# Altium schematic sheet zulu_a7_3.SchDoc
size 270 x 341 mm; Author: Christian Tambe; VERSION#: 1.0; Origin: Eagle; OriginPath: C:\Users\tambe\Documents\Electronics\Zulu_A7\Zulu_Altrium\zulu_a7.sch; OriginSheet: 4; OriginDescription: Memory
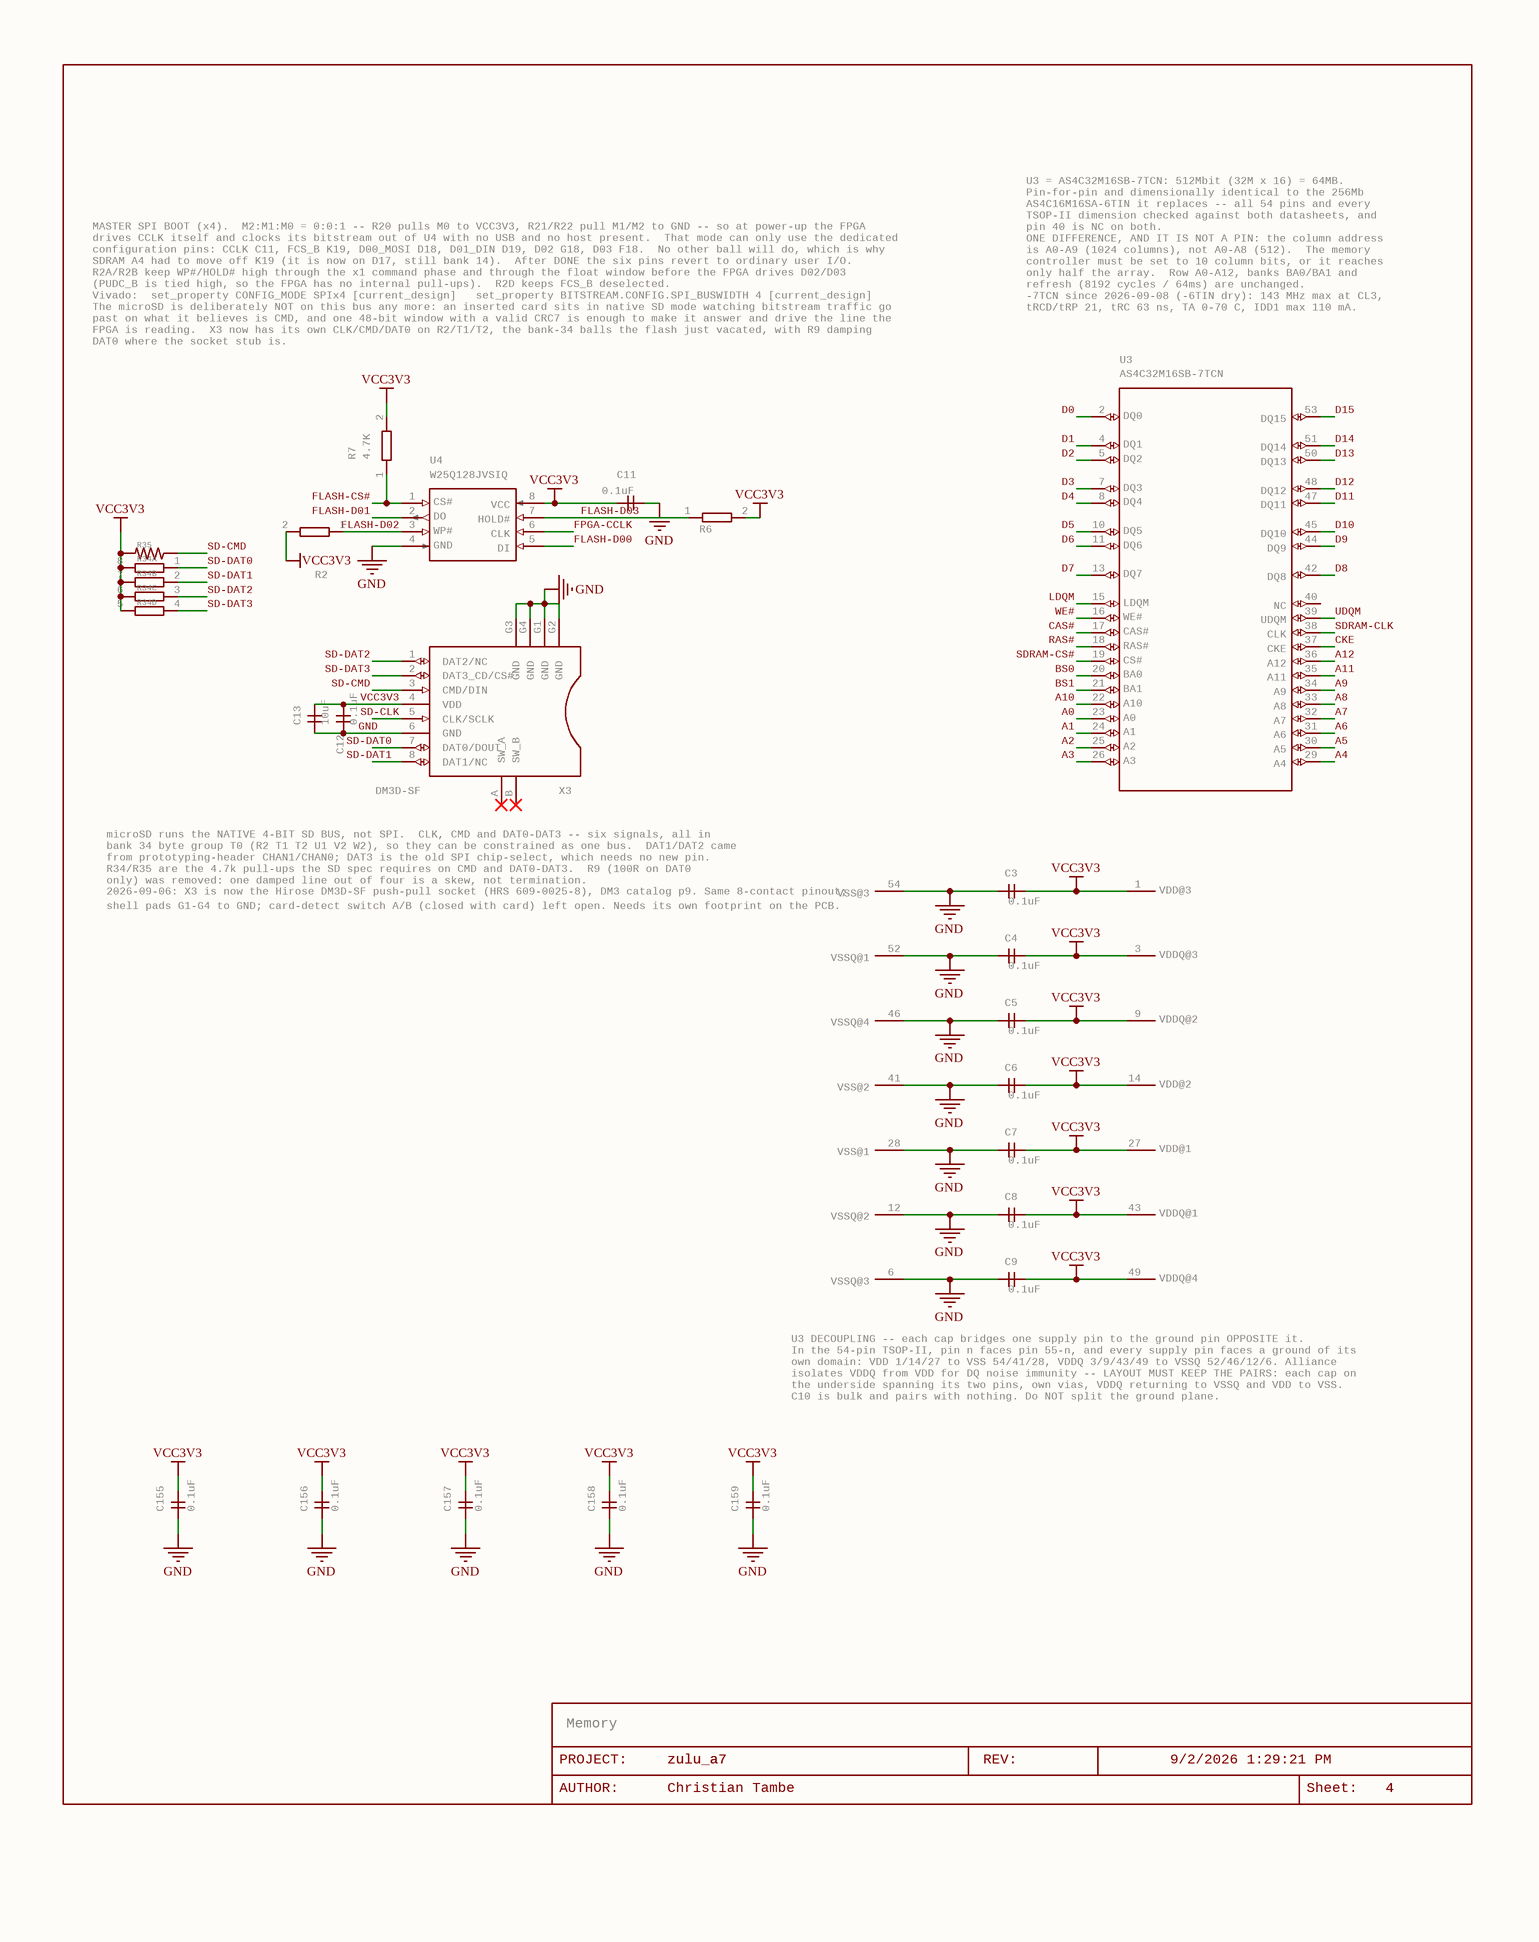
[diagram p0: zulu_a7_3.SchDoc]

## Parts
C3  0.1uF  [C0402]
C4  0.1uF  [C0402]
C5  0.1uF  [C0402]
C6  0.1uF  [C0402]
C7  0.1uF  [C0402]
C8  0.1uF  [C0402]
C9  0.1uF  [C0402]
C11  0.1uF  [C0402]
C12  0.1uF  [C0402]
C13  10uF  [C0603]
C155  0.1uF  [C0201]
C156  0.1uF  [C0201]
C157  0.1uF  [C0201]
C158  0.1uF  [C0201]
C159  0.1uF  [C0201]
FRAME7  LAST_DATE_TIME: 9/2/2026 1:29:21 PM  Sheet: Sheet:  SHEET: 4  REV: REV:  PROJECT: PROJECT:  DRAWING_NAME: zulu_a7  AUTHOR: Christian Tambe  (hidden comment: DOCFIELD)  (graphical)
R2  4.7K  [R0201]  (value not drawn)
R6  4.7K  [R0201]  (value not drawn)
R7  4.7K  [R0201]
R34  4.7K  [742C083]  (value not drawn)  (parts A,B,C,D of 4)
R35  4.7K  [R0402]  (value not drawn)
U3  AS4C32M16SB-7TCN  PART: U3  [TSOPII-54]  (parts A,B,C,D,E,F,G,H,I,J,K,L,M,N,O,P,Q,R,S,T,U,V,W,X,Y,Z,27,28,29,30,31,32,33,34,35,36,37,38,39,40,41,42,43,44,45,46,47,48,49,50,51,52,53,54,55 of 55)
U4  W25Q128JVSIQ  PART: U4  [SOIC-8_208MIL]  (parts A,B,C,D,E,F,G,H,I of 9)
X3  DM3D-SF  [DM3D-SF]

## Nets
GND: C3.1 C4.1 C5.1 C6.1 C7.1 C8.1 C9.1 C11.1 C12.1 C13.1 C155.1 C156.1 C157.1 C158.1 C159.1 U3.6(P$1) U3.12(P$1) U3.28(P$1) U3.41(P$1) U3.46(P$1) U3.52(P$1) U3.54(P$1) U4.4 X3.6(GND) X3.G1(GND) X3.G2(GND) X3.G3(GND) X3.G4(GND)
VCC3V3: C3.2 C4.2 C5.2 C6.2 C7.2 C8.2 C9.2 C11.2 C12.2 C13.2 C155.2 C156.2 C157.2 C158.2 C159.2 R2.2 R6.2 R7.2 R34.5 R34.6 R34.7 R34.8 R35.2 U3.1(P$1) U3.3(P$1) U3.9(P$1) U3.14(P$1) U3.27(P$1) U3.43(P$1) U3.49(P$1) U4.8 X3.4(VDD)
A0: U3.23(P$1)
A1: U3.24(P$1)
A2: U3.25(P$1)
A3: U3.26(P$1)
A4: U3.29(P$1)
A5: U3.30(P$1)
A6: U3.31(P$1)
A7: U3.32(P$1)
A8: U3.33(P$1)
A9: U3.34(P$1)
A10: U3.22(P$1)
A11: U3.35(P$1)
A12: U3.36(P$1)
BS0: U3.20(P$1)
BS1: U3.21(P$1)
CAS#: U3.17(P$1)
CKE: U3.37(P$1)
D0: U3.2(P$1)
D1: U3.4(P$1)
D2: U3.5(P$1)
D3: U3.7(P$1)
D4: U3.8(P$1)
D5: U3.10(P$1)
D6: U3.11(P$1)
D7: U3.13(P$1)
D8: U3.42(P$1)
D9: U3.44(P$1)
D10: U3.45(P$1)
D11: U3.47(P$1)
D12: U3.48(P$1)
D13: U3.50(P$1)
D14: U3.51(P$1)
D15: U3.53(P$1)
FLASH-CS#: R7.1 U4.1
FLASH-D00: U4.5
FLASH-D01: U4.2
FLASH-D02: R2.1 U4.3
FLASH-D03: R6.1 U4.7
FPGA-CCLK: U4.6
LDQM: U3.15(P$1)
RAS#: U3.18(P$1)
SD-CLK: X3.5(CLK/SCLK)
SD-CMD: R35.1 X3.3(CMD/DIN)
SD-DAT0: R34.1 X3.7(DAT0/DOUT)
SD-DAT1: R34.2 X3.8(DAT1/NC)
SD-DAT2: R34.3 X3.1(DAT2/NC)
SD-DAT3: R34.4 X3.2(DAT3_CD/CS#)
SDRAM-CLK: U3.38(P$1)
SDRAM-CS#: U3.19(P$1)
UDQM: U3.39(P$1)
WE#: U3.16(P$1)

Not connected (* = marked no-connect by the designer): U3 40(P$1); X3 A(SW_A)* B(SW_B)*

## Notes on the sheet
- (near U3) U3 = AS4C32M16SB-7TCN: 512Mbit (32M x 16) = 64MB.
  Pin-for-pin and dimensionally identical to the 256Mb
  AS4C16M16SA-6TIN it replaces -- all 54 pins and every
  TSOP-II dimension checked against both datasheets, and
  pin 40 is NC on both.
  ONE DIFFERENCE, AND IT IS NOT A PIN: the column address
  is A0-A9 (1024 columns), not A0-A8 (512).  The memory
  controller must be set to 10 column bits, or it reaches
  only half the array.  Row A0-A12, banks BA0/BA1 and
  refresh (8192 cycles / 64ms) are unchanged.
  -7TCN since 2026-09-08 (-6TIN dry): 143 MHz max at CL3,
  tRCD/tRP 21, tRC 63 ns, TA 0-70 C, IDD1 max 110 mA.
- MASTER SPI BOOT (x4).  M2:M1:M0 = 0:0:1 -- R20 pulls M0 to VCC3V3, R21/R22 pull M1/M2 to GND -- so at power-up the FPGA
  drives CCLK itself and clocks its bitstream out of U4 with no USB and no host present.  That mode can only use the dedicated
  configuration pins: CCLK C11, FCS_B K19, D00_MOSI D18, D01_DIN D19, D02 G18, D03 F18.  No other ball will do, which is why
  SDRAM A4 had to move off K19 (it is now on D17, still bank 14).  After DONE the six pins revert to ordinary user I/O.
  R2A/R2B keep WP#/HOLD# high through the x1 command phase and through the float window before the FPGA drives D02/D03
  (PUDC_B is tied high, so the FPGA has no internal pull-ups).  R2D keeps FCS_B deselected.
  Vivado:  set_property CONFIG_MODE SPIx4 [current_design]   set_property BITSTREAM.CONFIG.SPI_BUSWIDTH 4 [current_design]
  The microSD is deliberately NOT on this bus any more: an inserted card sits in native SD mode watching bitstream traffic go
  past on what it believes is CMD, and one 48-bit window with a valid CRC7 is enough to make it answer and drive the line the
  FPGA is reading.  X3 now has its own CLK/CMD/DAT0 on R2/T1/T2, the bank-34 balls the flash just vacated, with R9 damping
  DAT0 where the socket stub is.
- (near U3) microSD runs the NATIVE 4-BIT SD BUS, not SPI.  CLK, CMD and DAT0-DAT3 -- six signals, all in
  bank 34 byte group T0 (R2 T1 T2 U1 V2 W2), so they can be constrained as one bus.  DAT1/DAT2 came
  from prototyping-header CHAN1/CHAN0; DAT3 is the old SPI chip-select, which needs no new pin.
  R34/R35 are the 4.7k pull-ups the SD spec requires on CMD and DAT0-DAT3.  R9 (100R on DAT0
  only) was removed: one damped line out of four is a skew, not termination.
- 2026-09-06: X3 is now the Hirose DM3D-SF push-pull socket (HRS 609-0025-8), DM3 catalog p9. Same 8-contact pinout;
- shell pads G1-G4 to GND; card-detect switch A/B (closed with card) left open. Needs its own footprint on the PCB.
- U3 DECOUPLING -- each cap bridges one supply pin to the ground pin OPPOSITE it.
  In the 54-pin TSOP-II, pin n faces pin 55-n, and every supply pin faces a ground of its
  own domain: VDD 1/14/27 to VSS 54/41/28, VDDQ 3/9/43/49 to VSSQ 52/46/12/6. Alliance
  isolates VDDQ from VDD for DQ noise immunity -- LAYOUT MUST KEEP THE PAIRS: each cap on
  the underside spanning its two pins, own vias, VDDQ returning to VSSQ and VDD to VSS.
  C10 is bulk and pairs with nothing. Do NOT split the ground plane.
- (near FRAME7) Memory
- (near FRAME7) AUTHOR:

## Library data of the parts
C3-C9 C11 C12 = C-GENERICC0402: CAPACITOR, generic non-polarized, horizontal pins; GateName_1: G$1; SymbolName_1: C-GENERIC-H; MANF: Murata; MANF#: GRM155R71C104KA88D; SPEC: X7R 16V +-10%, 0.50 mm max; DeviceName: C0402; LibraryName: rcl; DeviceSetName: C-GENERIC
C13 = C-GENERICC0603: CAPACITOR, generic non-polarized, horizontal pins; GateName_1: G$1; SymbolName_1: C-GENERIC-H; MANF: Murata; MANF#: GRM188R60J106ME47D; SPEC: X5R 6.3V +-20%, 0.90 mm max; DeviceName: C0603; LibraryName: rcl; DeviceSetName: C-GENERIC
C155-C159 = C-GENERICC0201: CAPACITOR, generic non-polarized, horizontal pins; GateName_1: G$1; SymbolName_1: C-GENERIC-H; MANF: Murata; MANF#: GRM033R61A104KE15D; NOTE: RETURN-PATH STITCHING FOR THE L5 PLANE, NOT DECOUPLING.  L5 carries VCC3V3 and L2 carries GND, so a signal via that moves between an L2-referenced layer (Top, L3) and an L5-referenced one (L4, Bottom) has nowhere for its return current to go except through a VCC3V3-to-GND capacitor.  Fifty-two vias on this board do that and thirty-nine of them are the AS4C32M16SB bus; before these five parts the nearest such capacitor was a median of 3.30 mm and up to 12.70 mm away, because all forty-six sit in the y 3.0-4.2 row, round U1, or at x 2.6-7.6, and none was anywhere in x 12-39, y 6-25.4.  These five fill that hole: C155 (26.000,20.250) Top carries UDQM, CKE and A12; C156 (29.550,20.000) Bottom carries D10 and D11; C157 (39.050,18.000) Top carries D13 and is also the best path for D3 and D6; C158 (18.100,16.650) Top carries the west address row A5, A7, A9; C159 (23.300,7.500) Top carries the south control row BS0, RAS#, A0, A1, which had the worst return paths on the board.  THEIR VALUE IS IN THE PLACEMENT AND IN THE TWO VIAS BESIDE EACH ONE, NOT IN THE CAPACITANCE: with roughly 2 nH of mounting inductance a 100 nF 0201 self-resonates near 11 MHz, so at the 143 MHz bus clock and above the capacitance is irrelevant and the impedance is set entirely by the loop -- the unavoidable barrel across the 1.3512 mm L2-to-L5 cavity plus the pad-to-via tie, which is the one term a layout can shorten.  Each of these five is tied to its two planes by its own dedicated via 0.85-1.07 mm of copper away, against a 2.43 mm median for the other forty-six.  DO NOT move these parts, do not re-route or lengthen their stubs, do not delete either via, and do not substitute a larger case size: a 0402 would push the vias apart and undo the point.  If the value must change, smaller is better than larger.  Coordinates and the full measurement are in docs/stage5b_stitching_caps.md.; SPEC: X5R 10V +-10% 0201 0.1uF, 0.30 mm max -- VCC3V3-to-GND return-path stitch for the L5 plane change, added 2026-09-24; DeviceName: C0201; LibraryName: rcl; DeviceSetName: C-GENERIC
FRAME7 = DOCFIELD: DOCUMENT FIELD; GateName_1: G$1; SymbolName_1: DOCFIELD; LibraryName: ctambe; DeviceSetName: DOCFIELD
R2 R6 R7 = R-WIDER0201: RESISTOR, one element on the 0.4 in symbol   Same R1NV0 symbol the RES4 and RES8 arrays drew their elements with, so a part split out of an array keeps the exact symbol, pin span and position it had on the sheet and not one wire has to move. The 0.2 in R-US_SMALL symbol would have shifted both pins by 2.54 mm and stranded every net that touched them.; GateName_1: G$1; DeviceSetName: R-WIDE; MANF: Yageo; MANF#: RC0201FR-074K7L; SPEC: thick film +-1%, 1/20W, 0201; SymbolName_1: R1NV0; DeviceName: R0201; LibraryName: rcl
R34 = RES4742: Resistor 4-pack   Package of four resistors.; GateName_1: A; SymbolName_1: R1NV0; GateName_2: B; GateName_3: C; GateName_4: D; DeviceName: 742; DeviceSetName: RES4; MANF: CTS; MANF#: 742C083472JP; NOTE: The microSD DAT0-3 pull-ups, all four elements used -- which is what an array is actually for. R1, R2 and R4 used 2, 3 and 6 of theirs in the EAGLE original and were split into discretes during the import; on 2026-09-09 R1 and R4 went back into arrays of their own (742C043472JP and 742C163101JP), so all three arrays on this board are CTS 74x concave parts sharing one land-pattern rule. R2 is still a discrete. 4.7k is the conventional value for SD data lines and it was already chosen; only the part number was missing. 5 percent is ample for a pull-up, so this is a J part where the discrete resistors on this board are F. CTS 742C is the family the footprint is named after. Confirm the suffix -- it encodes tolerance and packaging and is the easy thing to get wrong.; SPEC: 4x4.7K isolated array 0603x4, 0.8 mm pitch; direct successor of the obsolete JTR; SymbolName_2: R1NV0; SymbolName_3: R1NV0; SymbolName_4: R1NV0; LibraryName: ctambe; DIGIKEY#: 742C083???JPCT-ND; MOUSER#: 774-742C083???JP
R35 = R-US_R0402: RESISTOR, American symbol; GateName_1: G$1; SymbolName_1: R-US; DeviceSetName: R-US_; MANF: Yageo; MANF#: RC0402FR-074K7L; SPEC: thick film +-1%, 1/16W, 0402; DeviceName: R0402; LibraryName: rcl
U3 = SDRAM-X16-ALLIANCE-512M: SDR SDRAM, x16, 54-pin TSOP-II   The 54-pin TSOP-II x16 SDR pinout is identical for 256Mb and 512Mb: both use row A0-A12 with banks BA0/BA1, and pin 40 is NC on both. They differ only in the column address width -- A0-A8 (512 columns) at 256Mb, A0-A9 (1024 columns) at 512Mb -- which is a memory-controller setting, not a wiring change.; GateName_1: PART_VALUE; SymbolName_1: PART_VALUE-SDRAM-X16; GateName_2: VDD@3; SymbolName_2: PL-SDRAM-X16; GateName_3: DQ0; GateName_4: VDDQ@3; GateName_5: DQ1; GateName_6: DQ2; GateName_7: VSSQ@3; GateName_8: DQ3; GateName_9: DQ4; GateName_10: VDDQ@2; GateName_11: DQ5; GateName_12: DQ6; GateName_13: VSSQ@2; GateName_14: DQ7; GateName_15: VDD@2; GateName_16: LDQM; GateName_17: WE#; GateName_18: CAS#; GateName_19: RAS#; GateName_20: CS#; GateName_21: BA0; GateName_22: BA1; GateName_23: A10; GateName_24: A0; GateName_25: A1; GateName_26: A2; GateName_27: A3; GateName_28: VDD@1; GateName_29: VSS@1; GateName_30: A4; GateName_31: A5; GateName_32: A6; GateName_33: A7; GateName_34: A8; GateName_35: A9; GateName_36: A11; GateName_37: A12; GateName_38: CKE; GateName_39: CLK; GateName_40: UDQM; GateName_42: VSS@2; GateName_43: DQ8; GateName_44: VDDQ@1; GateName_45: DQ9; GateName_46: DQ10; GateName_47: VSSQ@4; GateName_48: DQ11; GateName_49: DQ12; GateName_50: VDDQ@4; GateName_51: DQ13; GateName_52: DQ14; GateName_53: VSSQ@1; GateName_54: DQ15; GateName_55: VSS@3; MANF: Alliance Memory; NOTE: 512Mbit (32M x 16) = 64MB. Pin-for-pin and dimensionally identical to the 256Mb AS4C16M16SA-6TIN it replaces: all 54 pins and every TSOP-II dimension were checked against both datasheets, and pin 40 is NC on both. ONE DIFFERENCE, AND IT IS NOT A PIN -- the column address is A0-A9 (1024 columns) instead of A0-A8 (512). The memory controller must be set to 10 column bits or it reaches only half the array. Row A0-A12, banks BA0/BA1 and refresh (8192 cycles/64ms) are unchanged. IDD1 rises 60mA to 120mA on the 600mA VCC3V3 buck (LTC3569 SW3). 2026-09-08: AS4C32M16SB-6TIN replaced by AS4C32M16SB-7TCN (same B die, 54-TSOP II 400 mil and pinout, datasheet Rev 1.4 Table 2): -7 speed bin, 143 MHz max at CL3 (tCK 7 ns, tAC 5.4 ns), tRCD/tRP 21 ns, tRC/tRFC 63 ns, tRRD/tMRD/tWR 14 ns, tCH/tCL 2.5 ns; 100 MHz at CL2 for every grade. Commercial TA 0..70 C, matching the -1C FPGA. IDD1 max 110 mA (was 120). AS4C32M16SB-7TIN (industrial) is the timing-identical alternate; the -6TIN only if the controller is clocked above 143 MHz.; SymbolName_3: PL-SDRAM-X16; SymbolName_4: PL-SDRAM-X16; SymbolName_5: PL-SDRAM-X16; SymbolName_6: PL-SDRAM-X16; SymbolName_7: PL-SDRAM-X16; SymbolName_8: PL-SDRAM-X16; SymbolName_9: PL-SDRAM-X16; SymbolName_10: PL-SDRAM-X16; SymbolName_11: PL-SDRAM-X16; SymbolName_12: PL-SDRAM-X16; SymbolName_13: PL-SDRAM-X16; SymbolName_14: PL-SDRAM-X16; SymbolName_15: PL-SDRAM-X16; SymbolName_16: PL-SDRAM-X16; SymbolName_17: PL-SDRAM-X16; SymbolName_18: PL-SDRAM-X16; SymbolName_19: PL-SDRAM-X16; SymbolName_20: PL-SDRAM-X16; SymbolName_21: PL-SDRAM-X16; SymbolName_22: PL-SDRAM-X16; SymbolName_23: PL-SDRAM-X16; SymbolName_24: PL-SDRAM-X16; SymbolName_25: PL-SDRAM-X16; SymbolName_26: PL-SDRAM-X16; SymbolName_27: PL-SDRAM-X16; SymbolName_28: PL-SDRAM-X16; SymbolName_29: PL-SDRAM-X16; SymbolName_30: PL-SDRAM-X16; SymbolName_31: PL-SDRAM-X16; SymbolName_32: PL-SDRAM-X16; SymbolName_33: PL-SDRAM-X16; SymbolName_34: PL-SDRAM-X16; SymbolName_35: PL-SDRAM-X16; SymbolName_36: PL-SDRAM-X16; SymbolName_37: PL-SDRAM-X16; SymbolName_38: PL-SDRAM-X16; SymbolName_39: PL-SDRAM-X16; SymbolName_40: PL-SDRAM-X16; GateName_41: NC; SymbolName_41: PL-SDRAM-X16; SymbolName_42: PL-SDRAM-X16; SymbolName_43: PL-SDRAM-X16; SymbolName_44: PL-SDRAM-X16; SymbolName_45: PL-SDRAM-X16; SymbolName_46: PL-SDRAM-X16; SymbolName_47: PL-SDRAM-X16; SymbolName_48: PL-SDRAM-X16; SymbolName_49: PL-SDRAM-X16; SymbolName_50: PL-SDRAM-X16; SymbolName_51: PL-SDRAM-X16; SymbolName_52: PL-SDRAM-X16; SymbolName_53: PL-SDRAM-X16; SymbolName_54: PL-SDRAM-X16; SymbolName_55: PL-SDRAM-X16; DeviceName: -ALLIANCE-512M; LibraryName: ctambe; DeviceSetName: SDRAM-X16; MANF#: AS4C32M16SB-7TCN
U4 = SPI_FLASH-SOIC_150_208: SPI Flash; GateName_1: PART; SymbolName_1: PV_GATE; GateName_2: CS#; SymbolName_2: PIN_GATE_IN; GateName_3: DO; SymbolName_3: PIN_GATE_OUT; GateName_4: WP#; GateName_5: GND; GateName_6: DI; GateName_7: CLK; GateName_8: HOLD#; GateName_9: VCC; MANF: Winbond; NOTE: 128Mbit quad SPI, SOIC-8 208mil. The XC7A35T bitstream is 17,536,096 bits, so the previous W25Q80BV (8Mbit) could not boot the part at all. 128Mbit leaves ~14MB for user data above the bitstream.; SymbolName_4: PIN_GATE_IN; SymbolName_5: PIN_GATE_IN; SymbolName_6: PIN_GATE_IN; SymbolName_7: PIN_GATE_IN; SymbolName_8: PIN_GATE_IN; SymbolName_9: PIN_GATE_IN; DeviceName: -SOIC_150_208; LibraryName: ctambe; DeviceSetName: SPI_FLASH; DIGIKEY#: W25Q128JVSIQ-ND; MANF#: W25Q128JVSIQ
X3 = MICROSD_CONDM3D-SF: microSD socket, push-pull, Hirose DM3D-SF; GateName_1: G$1; HRS#: 609-0025-8; SPEC: microSD push-pull (no eject), top mount, 0.5 A; 8 contacts + 4 shell pads G1-G4 + card-detect switch A/B (open without card); DM3 catalog p9; SymbolName_1: MICROSD_CON; DeviceName: DM3D-SF; LibraryName: ctambe; DeviceSetName: MICROSD_CON; MANF: Hirose; MANF#: DM3D-SF; MOUSER#: MOUSER#